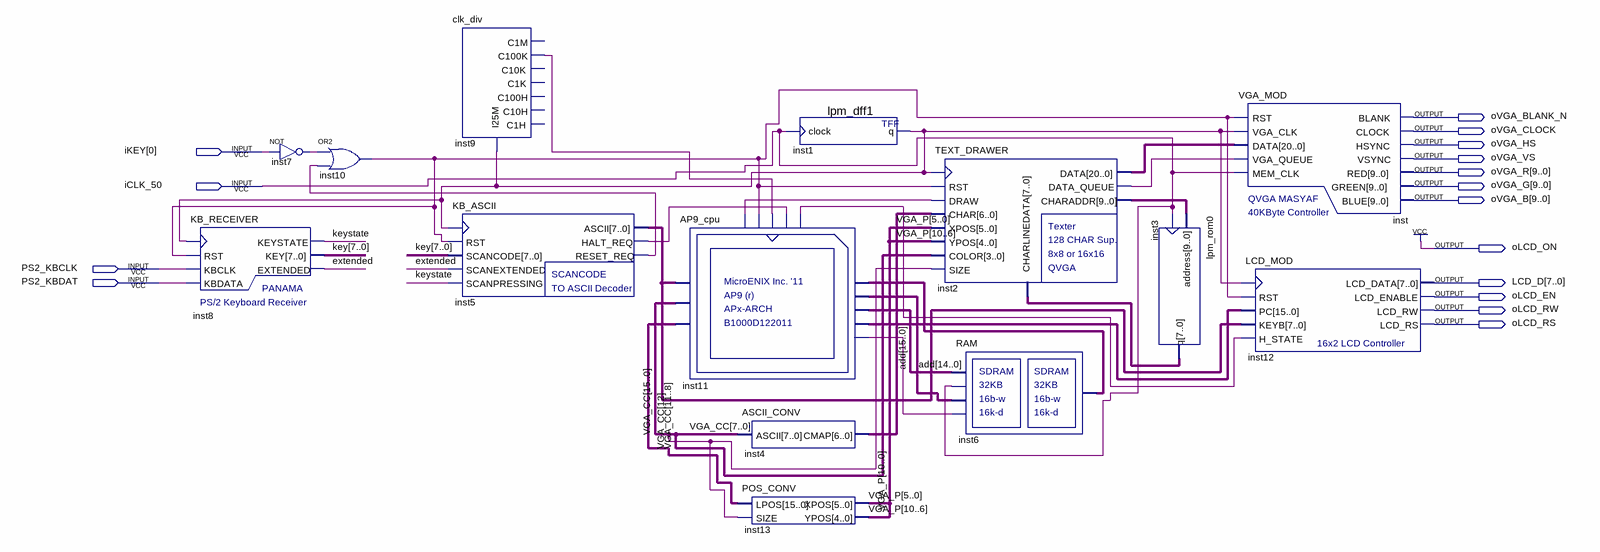
[diagram p0: schematic sheet]
// Quartus schematic AP9_b.bdf as structural Verilog: 14 symbols, 16 pins
module AP9_b (
  input  [0:0] iKEY,
  input  iCLK_50,
  input  PS2_KBCLK,
  input  PS2_KBDAT,
  output oVGA_BLANK_N,
  output oVGA_CLOCK,
  output oVGA_HS,
  output oVGA_VS,
  output [9:0] oVGA_R,
  output [9:0] oVGA_G,
  output [9:0] oVGA_B,
  output oLCD_ON,
  output [7:0] LCD_D,
  output oLCD_EN,
  output oLCD_RW,
  output oLCD_RS
);

  wire extended, inst1_q, inst2_data_queue, inst5_halt_req, inst5_reset_req, inst7_out, inst9_clock_100khz,
       inst10_out, inst11_halt_ack, inst11_mem_rw, inst11_vga_draw, keystate;
  wire [6:0] inst4_cmap;
  wire [7:0] inst3_q, inst5_ascii, key;
  wire [9:0] inst2_charaddr;
  wire [10:0] VGA_P;
  wire [15:0] add, inst6_q, inst11_mem_wdata, inst11_pc_data, inst11_vga_pos, VGA_CC;
  wire [20:0] inst2_data;

  KB_RECEIVER inst8 (
    .RST(inst10_out), .KBCLK(PS2_KBCLK), .KBDATA(PS2_KBDAT), .CLK(inst1_q), .KEYSTATE(keystate), .KEY(key),
    .EXTENDED(extended));
  not inst7 (inst7_out, iKEY[0]);
  or inst10 (inst10_out, inst7_out, inst5_reset_req);
  clk_div inst9 (
    .clock_25Mhz(inst1_q), .clock_100KHz(inst9_clock_100khz));  // open: clock_1MHz, clock_10KHz, clock_1KHz, clock_100Hz, clock_10Hz, clock_1Hz
  KB_ASCII inst5 (
    .RST(inst10_out), .SCANCODE(key), .SCANEXTENDED(extended), .SCANPRESSING(keystate), .CLK(inst1_q),
    .ASCII(inst5_ascii), .HALT_REQ(inst5_halt_req), .RESET_REQ(inst5_reset_req));
  AP9_cpu inst11 (
    .KEY(inst5_ascii), .MEM_DATA(inst6_q), .HALT_REQ(inst5_halt_req), .CLK(inst9_clock_100khz),
    .RST(inst10_out), .VGA_CC(VGA_CC), .VGA_POS(inst11_vga_pos), .MEM_RW(inst11_mem_rw),
    .PC_DATA(inst11_pc_data), .MEM_ADDR(add), .MEM_WDATA(inst11_mem_wdata), .HALT_ACK(inst11_halt_ack),
    .VGA_DRAW(inst11_vga_draw));
  ASCII_CONV inst4 (.ASCII(VGA_CC[7:0]), .CMAP(inst4_cmap));
  POS_CONV inst13 (.LPOS(inst11_vga_pos), .SIZE(VGA_CC[12]), .XPOS(VGA_P[5:0]), .YPOS(VGA_P[10:6]));
  lpm_dff1 inst1 (.clock(iCLK_50), .q(inst1_q));
  TEXT_DRAWER inst2 (
    .RST(inst10_out), .DRAW(inst11_vga_draw), .XPOS(VGA_P[5:0]), .YPOS(VGA_P[10:6]), .COLOR(VGA_CC[11:8]),
    .SIZE(VGA_CC[12]), .CHARLINEDATA(inst3_q), .CLK(inst1_q), .CHAR(inst4_cmap), .DATA(inst2_data),
    .DATA_QUEUE(inst2_data_queue), .CHARADDR(inst2_charaddr));
  RAM inst6 (.clock(iCLK_50), .data(inst11_mem_wdata), .wren(inst11_mem_rw), .address(add[14:0]), .q(inst6_q));
  lpm_rom0 inst3 (.clock(iCLK_50), .address(inst2_charaddr), .q(inst3_q));
  VGA_MOD inst (
    .RST(inst10_out), .VGA_CLK(inst1_q), .DATA(inst2_data), .VGA_QUEUE(inst2_data_queue), .MEM_CLK(iCLK_50),
    .BLANK(oVGA_BLANK_N), .CLOCK(oVGA_CLOCK), .HSYNC(oVGA_HS), .VSYNC(oVGA_VS), .RED(oVGA_R), .GREEN(oVGA_G),
    .BLUE(oVGA_B));
  LCD_MOD inst12 (
    .RST(inst10_out), .PC(inst11_pc_data), .KEYB(inst5_ascii), .H_STATE(inst11_halt_ack), .CLK(inst1_q),
    .LCD_DATA(LCD_D), .LCD_ENABLE(oLCD_EN), .LCD_RW(oLCD_RW), .LCD_RS(oLCD_RS));

  assign oLCD_ON = 1'b1;
endmodule
